# Altium project H_Bridge.PrjPCB
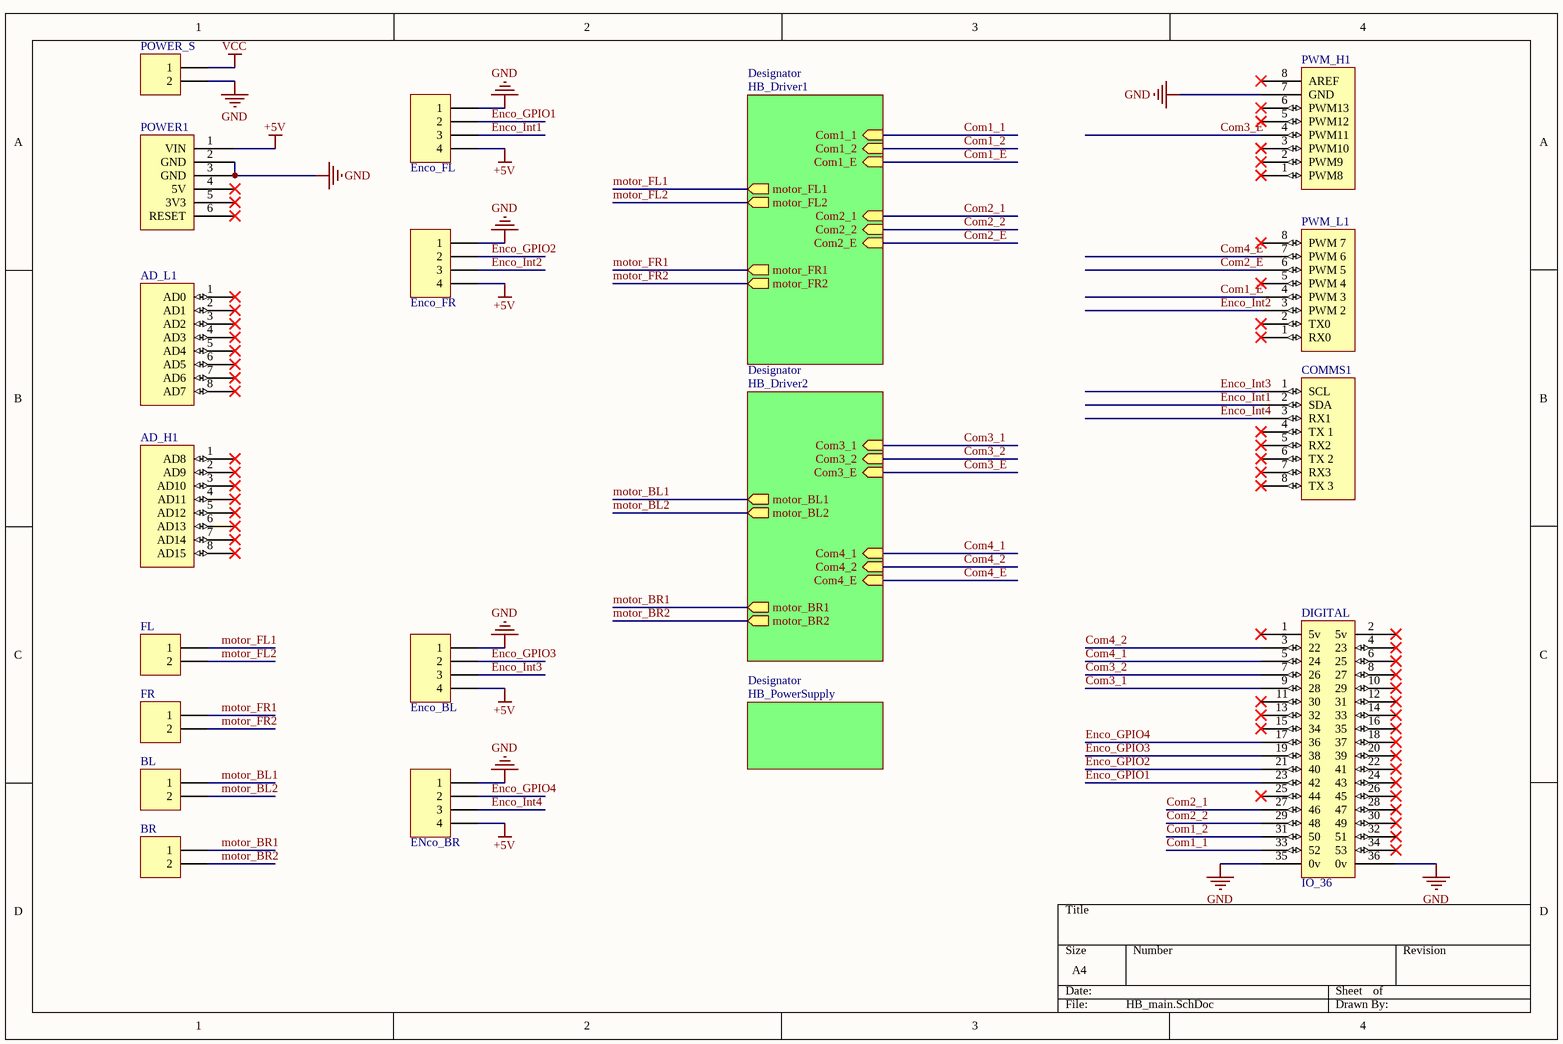
[diagram p0: HB_main.SchDoc]
4 sheets, 61 parts. Net scope: hierarchical (ports join the sheet entries above them; power ports are global).
Board file: HB.~(21).pcbdoc
Sheets:
  HB_main.SchDoc
    Designator = HB_Driver1.SchDoc
    Designator = HB_Driver2.SchDoc
    Designator = HB_PowerSupply.SchDoc

## Sheet HB_main.SchDoc
size A4

### Parts
AD_H1  AD_H  [Header 8x1 8.5mm]  (value not drawn)
AD_L1  AD_L  [Header 8x1 8.5mm]  (value not drawn)
COMMS1  Communication  [Header 8x1 8.5mm]  (value not drawn)
DIGITAL  IO_36  [HEADER 36X 8MM]
J3  POWER_S  [Header_2]
J4  FL  [Header_2]
J5  FR  [Header_2]
J6  BL  [Header_2]
J7  BR  [Header_2]
P1  Enco_FL  [MOLEX_22-27-2081]
P2  Enco_FR  [MOLEX_22-27-2081]
P3  Enco_BL  [MOLEX_22-27-2081]
P4  ENco_BR  [MOLEX_22-27-2081]
POWER1  POWER  [Header 6x1 8.5mm]  (value not drawn)
PWM_H1  PWM_H  [Header 8x1 8.5mm]  (value not drawn)
PWM_L1  PWM_L  [Header 8x1 8.5mm]  (value not drawn)

### Sub-sheets
Designator = HB_Driver1: Com2_E (in), Com1_1 (in), Com1_E (in), Com1_2 (in), Com2_2 (in), Com2_1 (in), motor_FR2 (out), motor_FL1 (out), motor_FR1 (out), motor_FL2 (out)
Designator = HB_Driver2: Com4_1 (in), Com3_E (in), Com4_E (in), Com3_2 (in), Com4_2 (in), Com3_1 (in), motor_BL2 (out), motor_BR1 (out), motor_BR2 (out), motor_BL1 (out)
Designator = HB_PowerSupply: no entries

### Nets
+5V: P1.4 P2.4 P3.4 P4.4 POWER1.1(VIN)
GND: DIGITAL.35(0v) DIGITAL.36(0v) J3.2 P1.1 P2.1 P3.1 P4.1 POWER1.2(GND) POWER1.3(GND) PWM_H1.7(GND)
VCC: J3.1
Com1_1: DIGITAL.33(52) ; sheet Designator/Com1_1
Com1_2: DIGITAL.31(50) ; sheet Designator/Com1_2
Com1_E: PWM_L1.4(PWM_3) ; sheet Designator/Com1_E
Com2_1: DIGITAL.27(46) ; sheet Designator/Com2_1
Com2_2: DIGITAL.29(48) ; sheet Designator/Com2_2
Com2_E: PWM_L1.6(PWM_5) ; sheet Designator/Com2_E
Com3_1: DIGITAL.9(28) ; sheet Designator/Com3_1
Com3_2: DIGITAL.7(26) ; sheet Designator/Com3_2
Com3_E: PWM_H1.4(PWM11) ; sheet Designator/Com3_E
Com4_1: DIGITAL.5(24) ; sheet Designator/Com4_1
Com4_2: DIGITAL.3(22) ; sheet Designator/Com4_2
Com4_E: PWM_L1.7(PWM_6) ; sheet Designator/Com4_E
Enco_GPIO1: DIGITAL.23(42) P1.2
Enco_GPIO2: DIGITAL.21(40) P2.2
Enco_GPIO3: DIGITAL.19(38) P3.2
Enco_GPIO4: DIGITAL.17(36) P4.2
Enco_Int1: COMMS1.2(SDA) P1.3
Enco_Int2: P2.3 PWM_L1.3(PWM_2)
Enco_Int3: COMMS1.1(SCL) P3.3
Enco_Int4: COMMS1.3(RX1) P4.3
motor_BL1: J6.1 ; sheet Designator/motor_BL1
motor_BL2: J6.2 ; sheet Designator/motor_BL2
motor_BR1: J7.1 ; sheet Designator/motor_BR1
motor_BR2: J7.2 ; sheet Designator/motor_BR2
motor_FL1: J4.1 ; sheet Designator/motor_FL1
motor_FL2: J4.2 ; sheet Designator/motor_FL2
motor_FR1: J5.1 ; sheet Designator/motor_FR1
motor_FR2: J5.2 ; sheet Designator/motor_FR2

Not connected (* = marked no-connect by the designer): AD_H1 1(AD8)* 2(AD9)* 3(AD10)* 4(AD11)* 5(AD12)* 6(AD13)* 7(AD14)* 8(AD15)*; AD_L1 1(AD0)* 2(AD1)* 3(AD2)* 4(AD3)* 5(AD4)* 6(AD5)* 7(AD6)* 8(AD7)*; COMMS1 4(TX_1)* 5(RX2)* 6(TX_2)* 7(RX3)* 8(TX_3)*; DIGITAL 1(5v)* 2(5v)* 4(23)* 6(25)* 8(27)* 10(29)* 11(30)* 12(31)* 13(32)* 14(33)* 15(34)* 16(35)* 18(37)* 20(39)* 22(41)* 24(43)* 25(44)* 26(45)* 28(47)* 30(49)* 32(51)* 34(53)*; POWER1 4(5V)* 5(3V3)* 6(RESET)*; PWM_H1 1(PWM8)* 2(PWM9)* 3(PWM10)* 5(PWM12)* 6(PWM13)* 8(AREF)*; PWM_L1 1(RX0)* 2(TX0)* 5(PWM_4)* 8(PWM_7)*

### Library data of the parts
AD_H1 = AD_H: Header, 8-Pin; Supplier: Farnell 2505051
AD_L1 = AD_L: Header, 8-Pin; Supplier: Farnell 2505051
COMMS1 = Communication: Header, 8-Pin; Supplier: Farnell 2505051
DIGITAL = IO_36: Header, 36-Pin; Supplier: RS 180-0956
J3-J7 = Connecteur 2: Connecteur; Designer: ECAM 2005; Supplier: ECAM; Type: Connecteur à vis
P1-P4 = Header 4: Header, 4-Pin; LatestRevisionDate: 17-Jul-2002; LatestRevisionNote: Re-released for DXP Platform.; Publisher: Altium Limited; Supplier: Farnell 9731164
POWER1 = POWER: Header, 6-Pin; Supplier: Farnell 2578705
PWM_H1 = PWM_H: Header, 8-Pin; Supplier: Farnell 2505051
PWM_L1 = PWM_L: Header, 8-Pin; Supplier: Farnell 2505051

## Sheet HB_Driver1.SchDoc
size A4
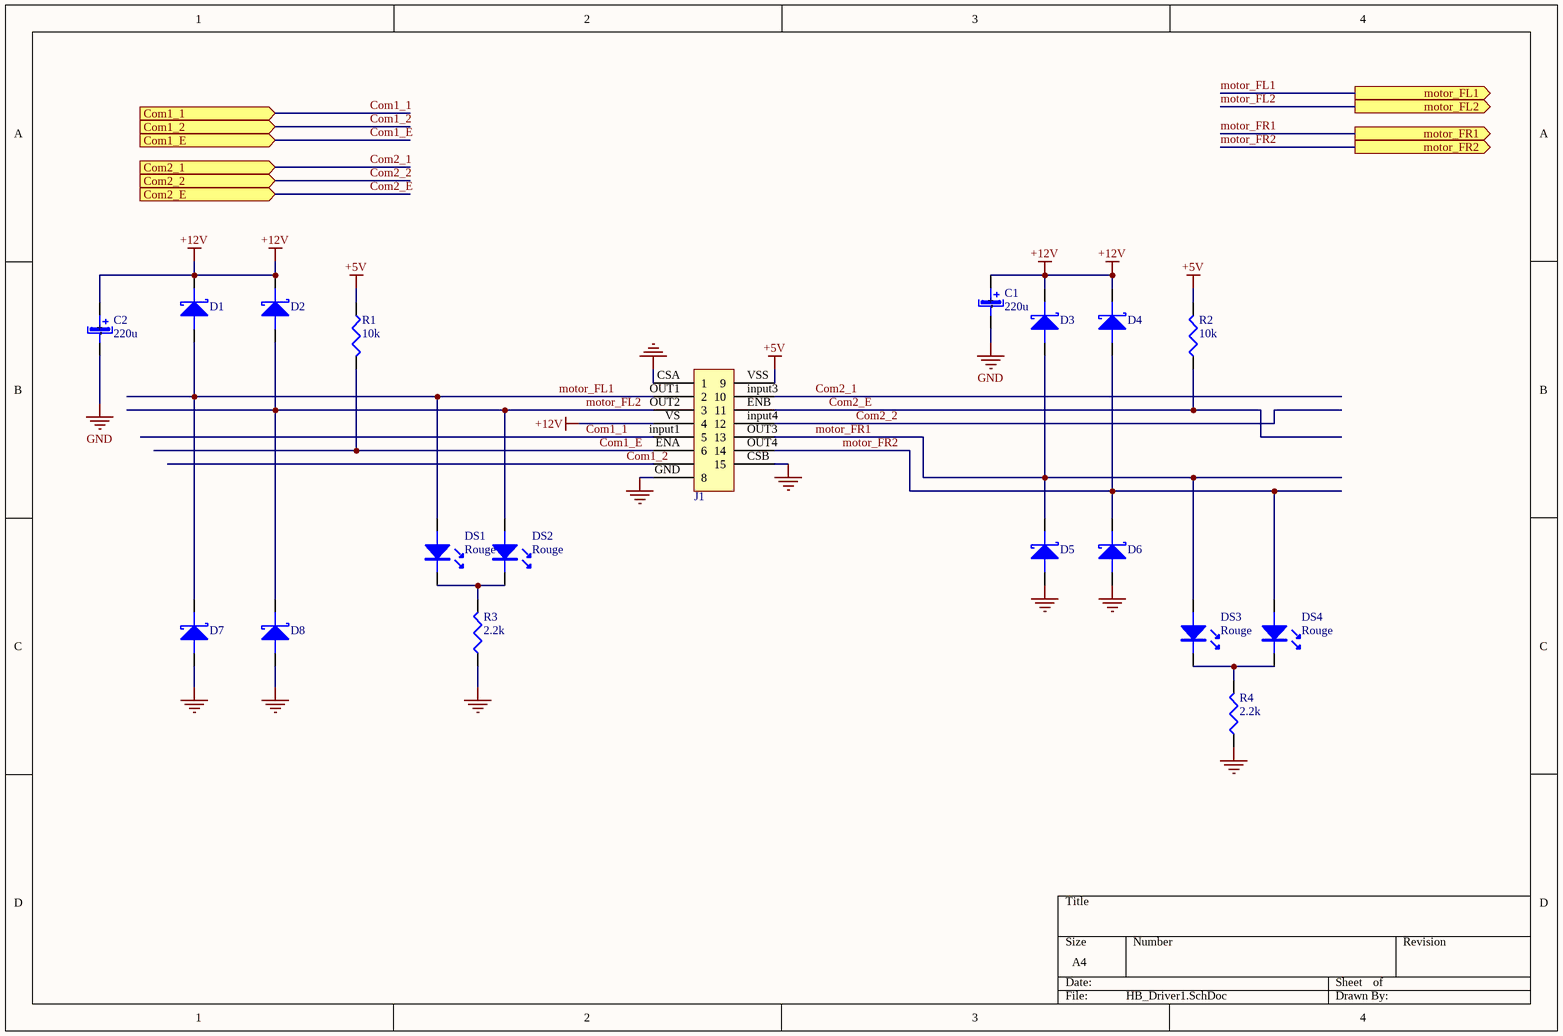
[diagram p1: HB_Driver1.SchDoc]

### Parts
C1  value 220u  [CAPAE0810X700N]  (hidden comment: Cap_220u)
C2  value 220u  [CAPAE0810X700N]  (hidden comment: Cap_220u)
D1  Diode Schottky  [SOD-123]  (value not drawn)
D2  Diode Schottky  [SOD-123]  (value not drawn)
D3  Diode Schottky  [SOD-123]  (value not drawn)
D4  Diode Schottky  [SOD-123]  (value not drawn)
D5  Diode Schottky  [SOD-123]  (value not drawn)
D6  Diode Schottky  [SOD-123]  (value not drawn)
D7  Diode Schottky  [SOD-123]  (value not drawn)
D8  Diode Schottky  [SOD-123]  (value not drawn)
DS1  Color: Rouge  [3.5X2.8X1.9]  (hidden comment: LED)
DS2  Color: Rouge  [3.5X2.8X1.9]  (hidden comment: LED)
DS3  Color: Rouge  [3.5X2.8X1.9]  (hidden comment: LED)
DS4  Color: Rouge  [3.5X2.8X1.9]  (hidden comment: LED)
J1  L298  [MultiWatt15]  (value not drawn)
R1  value 10k  [6-0805_L]  (hidden comment: Res_10k)
R2  value 10k  [6-0805_L]  (hidden comment: Res_10k)
R3  value 2.2k  [6-0805_L]  (hidden comment: Res_2.2k)
R4  value 2.2k  [6-0805_L]  (hidden comment: Res_2.2k)

### Ports
Com1_1 (in), Com1_2 (in), Com1_E (in), Com2_1 (in), Com2_2 (in), Com2_E (in), motor_FL1 (out), motor_FL2 (out), motor_FR1 (out), motor_FR2 (out)

### Nets
+5V: J1.VSS(9) R1.1 R2.2
+12V: C1.POS(+) C2.POS(+) D1.1(K) D2.1(K) D3.1(K) D4.1(K) J1.VS(4)
GND: C1.NEG(-) C2.NEG(-) D5.2(A) D6.2(A) D7.2(A) D8.2(A) J1.CSA(1) J1.CSB(15) J1.GND(8) R3.1 R4.1
Com1_1: J1.input1(5) ; port Com1_1
Com1_2: J1.input2 ; port Com1_2
Com1_E: J1.ENA(6) R1.2 ; port Com1_E
Com2_1: J1.input3(10) ; port Com2_1
Com2_2: J1.input4(12) ; port Com2_2
Com2_E: J1.ENB(11) R2.1 ; port Com2_E
motor_FL1: D1.2(A) D7.1(K) DS1.1(A) J1.OUT1(2) ; port motor_FL1
motor_FL2: D2.2(A) D8.1(K) DS2.1(A) J1.OUT2(3) ; port motor_FL2
motor_FR1: D3.2(A) D5.1(K) DS3.1(A) J1.OUT3(13) ; port motor_FR1
motor_FR2: D4.2(A) D6.1(K) DS4.1(A) J1.OUT4(14) ; port motor_FR2
NetDS1_2: DS1.2(K) DS2.2(K) R3.2
NetDS3_2: DS3.2(K) DS4.2(K) R4.2

### Library data of the parts
C1 C2 = Cap_220u: Condensateur polatisé; Type: Condensateur polarisé debout; Designer: ECAM 2004; Supplier: RS 537-0641
J1 = L298: Connecteur; Designer: ECAM 2004; Supplier: ECAM
R1 R2 = Res_10k: Résistance standard; Designer: ECAM 2005; Supplier: RS 740-8805; Type: Résistance standard
R3 R4 = Res_2.2k: Résistance standard; Designer: ECAM 2005; Supplier: RS 679-1207; Type: Résistance standard
D1-D8 = Diode Schottky: Designer: ECAM 2005; Supplier: RS 708-2197
DS1-DS4 = LED: Designer: ECAM 2004; Type: LED; Supplier: RS 176-6077

## Sheet HB_Driver2.SchDoc
size A4
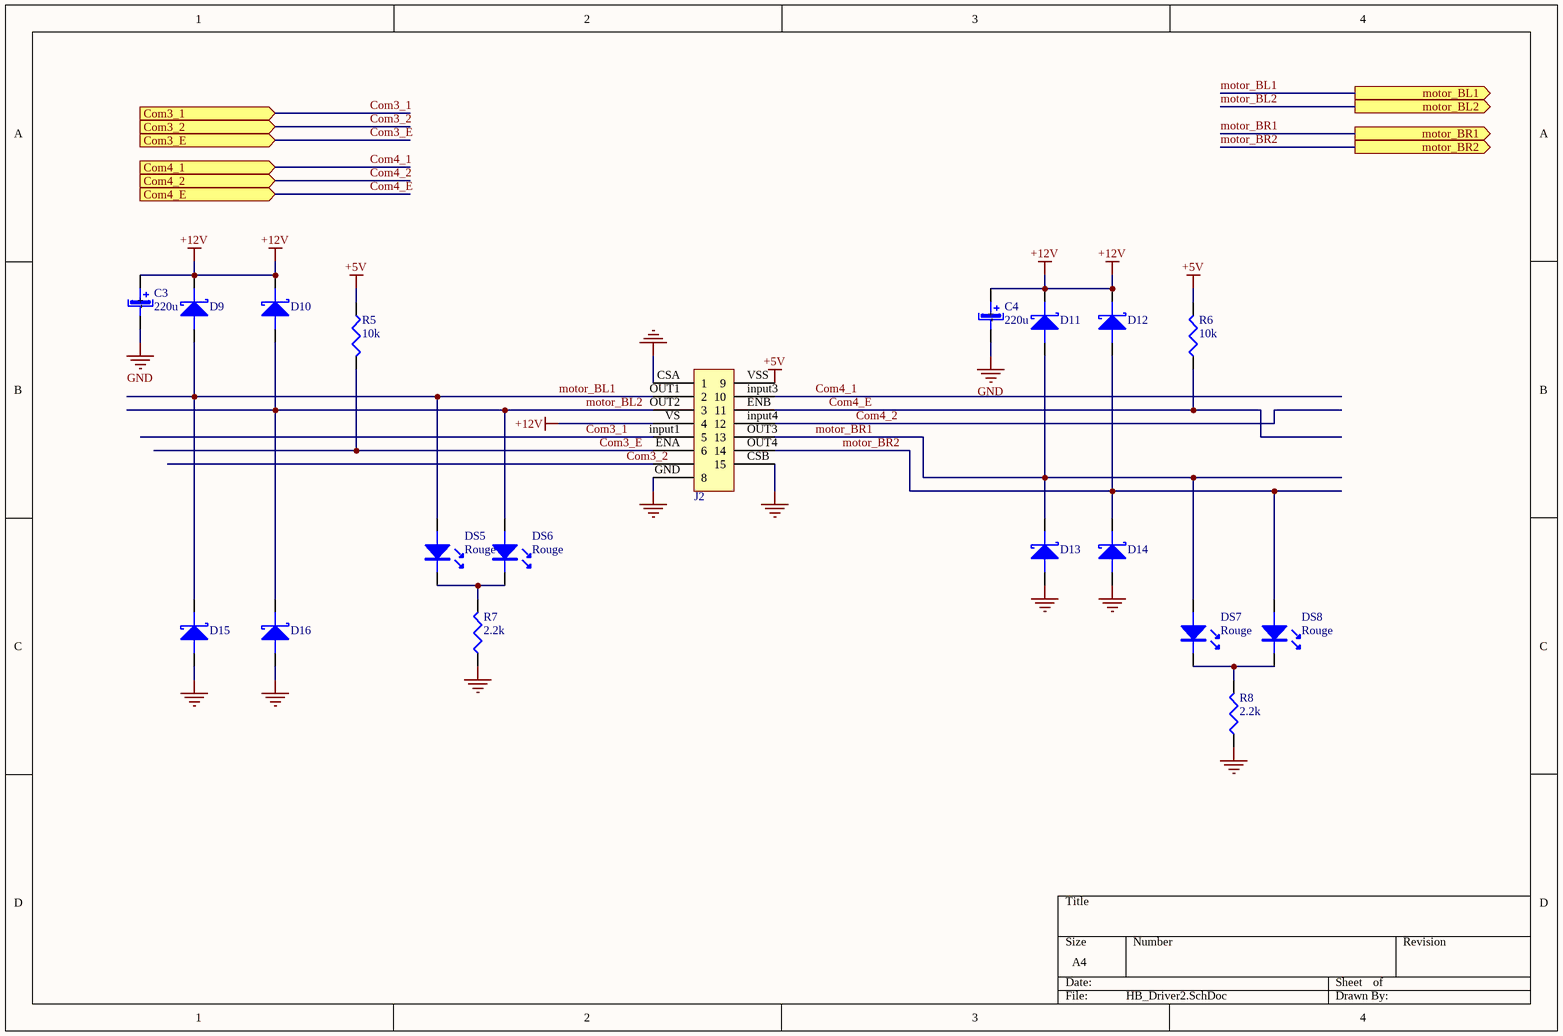
[diagram p2: HB_Driver2.SchDoc]

### Parts
C3  value 220u  [CAPAE0810X700N]  (hidden comment: Cap_220u)
C4  value 220u  [CAPAE0810X700N]  (hidden comment: Cap_220u)
D9  Diode Schottky  [SOD-123]  (value not drawn)
D10  Diode Schottky  [SOD-123]  (value not drawn)
D11  Diode Schottky  [SOD-123]  (value not drawn)
D12  Diode Schottky  [SOD-123]  (value not drawn)
D13  Diode Schottky  [SOD-123]  (value not drawn)
D14  Diode Schottky  [SOD-123]  (value not drawn)
D15  Diode Schottky  [SOD-123]  (value not drawn)
D16  Diode Schottky  [SOD-123]  (value not drawn)
DS5  Color: Rouge  [3.5X2.8X1.9]  (hidden comment: LED)
DS6  Color: Rouge  [3.5X2.8X1.9]  (hidden comment: LED)
DS7  Color: Rouge  [3.5X2.8X1.9]  (hidden comment: LED)
DS8  Color: Rouge  [3.5X2.8X1.9]  (hidden comment: LED)
J2  L298  [MultiWatt15]  (value not drawn)
R5  value 10k  [6-0805_L]  (hidden comment: Res_10k)
R6  value 10k  [6-0805_L]  (hidden comment: Res_10k)
R7  value 2.2k  [6-0805_L]  (hidden comment: Res_2.2k)
R8  value 2.2k  [6-0805_L]  (hidden comment: Res_2.2k)

### Ports
Com3_1 (in), Com3_2 (in), Com3_E (in), Com4_1 (in), Com4_2 (in), Com4_E (in), motor_BL1 (out), motor_BL2 (out), motor_BR1 (out), motor_BR2 (out)

### Nets
+5V: J2.VSS(9) R5.1 R6.2
+12V: C3.POS(+) C4.POS(+) D9.1(K) D10.1(K) D11.1(K) D12.1(K) J2.VS(4)
GND: C3.NEG(-) C4.NEG(-) D13.2(A) D14.2(A) D15.2(A) D16.2(A) J2.CSA(1) J2.CSB(15) J2.GND(8) R7.1 R8.1
Com3_1: J2.input1(5) ; port Com3_1
Com3_2: J2.input2 ; port Com3_2
Com3_E: J2.ENA(6) R5.2 ; port Com3_E
Com4_1: J2.input3(10) ; port Com4_1
Com4_2: J2.input4(12) ; port Com4_2
Com4_E: J2.ENB(11) R6.1 ; port Com4_E
motor_BL1: D9.2(A) D15.1(K) DS5.1(A) J2.OUT1(2) ; port motor_BL1
motor_BL2: D10.2(A) D16.1(K) DS6.1(A) J2.OUT2(3) ; port motor_BL2
motor_BR1: D11.2(A) D13.1(K) DS7.1(A) J2.OUT3(13) ; port motor_BR1
motor_BR2: D12.2(A) D14.1(K) DS8.1(A) J2.OUT4(14) ; port motor_BR2
NetDS5_2: DS5.2(K) DS6.2(K) R7.2
NetDS7_2: DS7.2(K) DS8.2(K) R8.2

### Library data of the parts
C3 C4 = Cap_220u: as C1 on sheet HB_Driver1; Designer: ECAM 2004; Supplier: RS 537-0641
J2 = L298: Connecteur; Designer: ECAM 2004; Supplier: ECAM
R5 R6 = Res_10k: Résistance standard; Designer: ECAM 2005; Supplier: RS 740-8805; Type: Résistance standard
R7 R8 = Res_2.2k: Résistance standard; Designer: ECAM 2005; Supplier: RS 679-1207; Type: Résistance standard
D9-D16 = Diode Schottky: Designer: ECAM 2005; Supplier: RS 708-2197
DS5-DS8 = LED: Designer: ECAM 2004; Type: LED; Supplier: RS 176-6077

## Sheet HB_PowerSupply.SchDoc
size A4
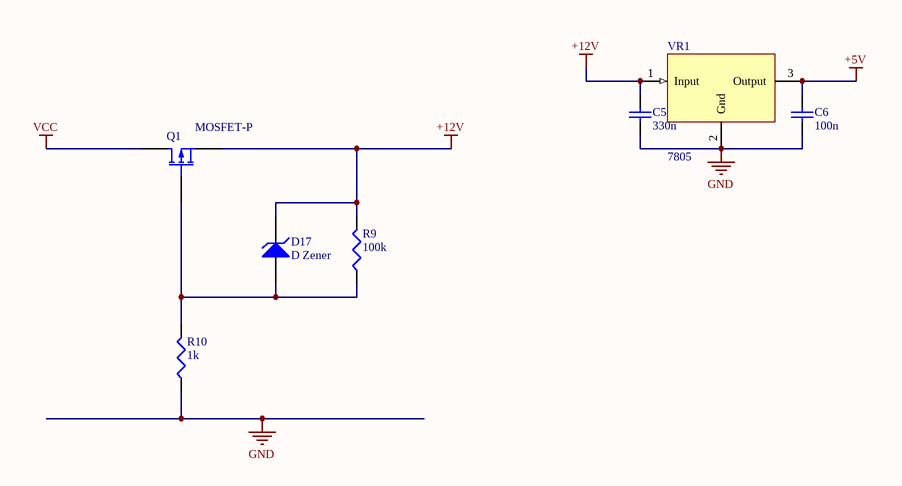
[diagram p3: HB_PowerSupply.SchDoc]

### Parts
C5  value 330n  [C1206]  (hidden comment: Cap_330n)
C6  value 100n  [C1206]  (hidden comment: Cap_100n)
D17  D Zener  [SOD-123]
Q1  MOSFET-P  [TO-220-AB]
R9  value 100k  [6-0805_L]  (hidden comment: Res_100k)
R10  value 1k  [6-0805_L]  (hidden comment: Res_1k)
VR1  7805  [TO-220AB]

### Nets
+5V: C6.1 VR1.3(Output)
+12V: C5.1 D17.1(K) Q1.S R9.2 VR1.1(Input)
GND: C5.2 C6.2 R10.1 VR1.2(Gnd)
VCC: Q1.D
NetD17_2: D17.2(A) Q1.G R9.1 R10.2

### Library data of the parts
C5 = Cap_330n: Condensateur; Supplier: Farnell  2320905; Designer: ECAM 2004
C6 = Cap_100n: Condensateur; Supplier: Farnell  2534095; Designer: ECAM 2004
D17 = D Zener: Zener Diode; Published: 8-Jun-2000; LatestRevisionDate: 17-Jul-2002; LatestRevisionNote: Re-released for DXP Platform.; PackageReference: DIODE-0.7; Publisher: Altium Limited; PackageDescription: Diode, Thru-Hole; 2 Leads; 0.7 in Pin Spacing; Supplier: RS 687-8146
Q1 = MOSFET-P: P-Channel MOSFET; Published: 8-Jun-2000; LatestRevisionDate: 17-Jul-2002; LatestRevisionNote: Re-released for DXP Platform.; PackageVersion: 1995/1996; PackageReference: E3; Publisher: Altium Limited; PackageDescription: TO, Flat Index; 3 In-Line, Axial Leads; Body Dia. 4.6mm; Lead Dia. 0.5 mm (max); Supplier: RS 760-4246
R9 = Res_100k: Résistance standard; Designer: ECAM 2005; Supplier: RS 740-8802; Type: Résistance standard
R10 = Res_1k: Résistance standard; Designer: ECAM 2005; Supplier: RS 566-800; Type: Résistance standard
VR1 = 7805: Régulateur 5V; Supplier: RS 536-0969; Designer: ECAM 2004; Type: 7805

## Nets that join several sheets
+5V: HB_main (5 pins), HB_Driver1 (J1.VSS R1.1 R2.2), HB_Driver2 (J2.VSS R5.1 R6.2), HB_PowerSupply (C6.1 VR1.3)
+12V: HB_Driver1 (7 pins), HB_Driver2 (7 pins), HB_PowerSupply (5 pins)
GND: HB_main (10 pins), HB_Driver1 (11 pins), HB_Driver2 (11 pins), HB_PowerSupply (C5.2 C6.2 R10.1 VR1.2)
VCC: HB_main (J3.1), HB_PowerSupply (Q1.D)
Com1_1: HB_main (DIGITAL.33), HB_Driver1 (J1.input1)
Com1_2: HB_main (DIGITAL.31), HB_Driver1 (J1.input2)
Com1_E: HB_main (PWM_L1.4), HB_Driver1 (J1.ENA R1.2)
Com2_1: HB_main (DIGITAL.27), HB_Driver1 (J1.input3)
Com2_2: HB_main (DIGITAL.29), HB_Driver1 (J1.input4)
Com2_E: HB_main (PWM_L1.6), HB_Driver1 (J1.ENB R2.1)
Com3_1: HB_main (DIGITAL.9), HB_Driver2 (J2.input1)
Com3_2: HB_main (DIGITAL.7), HB_Driver2 (J2.input2)
Com3_E: HB_main (PWM_H1.4), HB_Driver2 (J2.ENA R5.2)
Com4_1: HB_main (DIGITAL.5), HB_Driver2 (J2.input3)
Com4_2: HB_main (DIGITAL.3), HB_Driver2 (J2.input4)
Com4_E: HB_main (PWM_L1.7), HB_Driver2 (J2.ENB R6.1)
motor_BL1: HB_main (J6.1), HB_Driver2 (D9.2 D15.1 DS5.1 J2.OUT1)
motor_BL2: HB_main (J6.2), HB_Driver2 (D10.2 D16.1 DS6.1 J2.OUT2)
motor_BR1: HB_main (J7.1), HB_Driver2 (D11.2 D13.1 DS7.1 J2.OUT3)
motor_BR2: HB_main (J7.2), HB_Driver2 (D12.2 D14.1 DS8.1 J2.OUT4)
motor_FL1: HB_main (J4.1), HB_Driver1 (D1.2 D7.1 DS1.1 J1.OUT1)
motor_FL2: HB_main (J4.2), HB_Driver1 (D2.2 D8.1 DS2.1 J1.OUT2)
motor_FR1: HB_main (J5.1), HB_Driver1 (D3.2 D5.1 DS3.1 J1.OUT3)
motor_FR2: HB_main (J5.2), HB_Driver1 (D4.2 D6.1 DS4.1 J1.OUT4)